# Altium schematic sheet Main Controller.SchDoc: Microcontrollers and Peripherals
size A4; Date: May 2021; Revision: 1.0; SheetNumber: 1; SheetTotal: 1
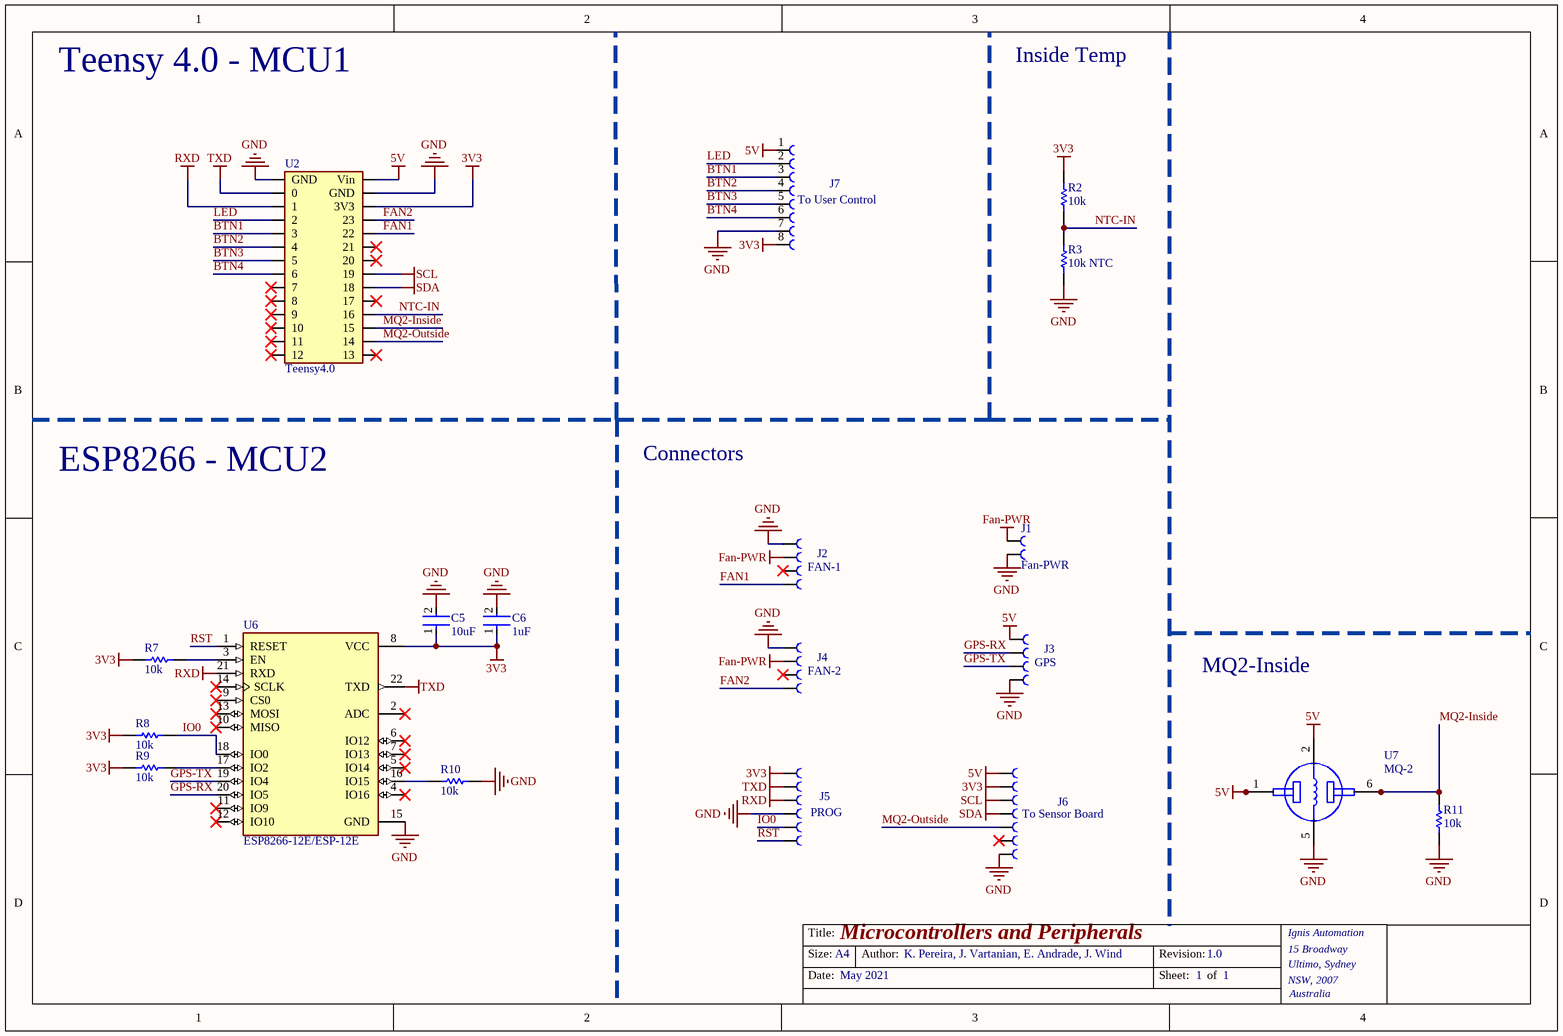
[diagram p0: Main Controller.SchDoc]

## Parts
C5  10uF  [FP-CL10-IPC_C]
C6  1uF  [FP-CL10-IPC_C]
J1  Fan-PWR  [61300711821]
J2  FAN-1  [61300711821]
J3  GPS  [61300711821]
J4  FAN-2  [61300711821]
J5  PROG  [61300711821]
J6  To Sensor Board  [61300711821]
J7  To User Control  [61300711821]
R2  10k  [RESC1608X55X30NL15T15]
R3  10k NTC  [RESC1608X55X30NL15T15]
R7  10k  [RESC1608X55X30NL15T15]
R8  10k  [RESC1608X55X30NL15T15]
R9  10k  [RESC1608X55X30NL15T15]
R10  10k  [RESC1608X55X30NL15T15]
R11  10k  [RESC1608X55X30NL15T15]
U2  Teensy4.0  [61301411821]
U6  ESP8266-12E/ESP-12E  [XCVR_ESP8266-12E/ESP-12E]
U7  MQ-2  [XDCR_SEN-08880]

## Nets
3V3: C5.1 C6.1 J5.1 J6.2 J7.8 R2.2 R7.1 R8.1 R9.1 U2.26(3V3) U6.8(VCC)
5V: J3.1 J6.1 J7.1 U2.28(Vin) U7.1(A) U7.2(H1) U7.3(A)
Fan-PWR: J1.2 J2.2 J4.2
GND: C5.2 C6.2 J1.1 J2.1 J3.4 J4.1 J5.4 J6.7 J7.7 R3.1 R10.2 R11.1 U2.1(GND) U2.27(GND) U6.15(GND) U7.5(H2)
RXD: J5.3 U2.3(1) U6.21(RXD)
SCL: J6.3 U2.21(19)
SDA: J6.4 U2.20(18)
TXD: J5.2 U2.2(0) U6.22(TXD)
BTN1: J7.3 U2.5(3)
BTN2: J7.4 U2.6(4)
BTN3: J7.5 U2.7(5)
BTN4: J7.6 U2.8(6)
FAN1: J2.4 U2.24(22)
FAN2: J4.4 U2.25(23)
GPS-RX: J3.2 U6.20(IO5)
GPS-TX: J3.3 U6.19(IO4)
IO0: J5.5 R8.2 U6.18(IO0)
LED: J7.2 U2.4(2)
MQ2-Inside: R11.2 U2.17(15) U7.4(B) U7.6(B)
MQ2-Outside: J6.5 U2.16(14)
NTC-IN: R2.1 R3.2 U2.18(16)
RST: J5.6 U6.1(RESET)
NetR7_2: R7.2 U6.3(EN)
NetR9_2: R9.2 U6.17(IO2)
NetR10_1: R10.1 U6.16(IO15)

Not connected (* = marked no-connect by the designer): J2 3*; J4 3*; J6 6*; U2 9(7)* 10(8)* 11(9)* 12(10)* 13(11)* 14(12)* 15(13)* 19(17)* 22(20)* 23(21)*; U6 2(ADC)* 4(IO16)* 5(IO14)* 6(IO12)* 7(IO13)* 9(CS0)* 10(MISO)* 11(IO9)* 12(IO10)* 13(MOSI)* 14(SCLK)*

## Notes on the sheet
- Teensy 4.0 - MCU1
- Inside Temp
- ESP8266 - MCU2
- Connectors
- MQ2-Inside
- Title:
- Size:
- Date:
- A4
- Author:
- K. Pereira, J. Vartanian, E. Andrade, J. Wind
- Revision:
- Sheet:
- of
- Ignis Automation
- 15 Broadway
- Ultimo, Sydney
- NSW, 2007
- Australia

## Library data of the parts
C5 = CMP-13271-003248-1: CAP CER 10UF 16V X5R 0603; Part Number: 587-3238-1-ND
C6 = CMP-13271-003248-1: CAP CER 1UF 25V X5R 0603; Part Number: 1276-1102-1-ND
J1 = 61300711821: 2 Pin
J2-J4 = 61300711821: 4 Pin
J5 = 61300711821: 6 Pin
J6 = 61300711821: 7 Pin
J7 = 61300711821: 8 Pin; MF: WÃ¼rth Elektronik; Check_prices: https://www.snapeda.com/parts/61300711821/W%C3%BCrth%20Elektronik/view-part/2704590/?ref=eda; Price: None; Availability: Unavailable; Value: *; SnapEDA_Link: https://www.snapeda.com/parts/61300711821/W%C3%BCrth%20Elektronik/view-part/2704590/?ref=snap; Package: None; MP: 61300711821
R2 R7-R11 = CMP-2000-00180-1: RES SMD 10K OHM 1% 1/10W 0603; Part Number: A121523CT-ND
R3 = CMP-2000-00180-1: THERMISTOR NTC 10KOHM 4250K 0603; Part Number: P10547CT-ND
U6 = ESP8266-12E/ESP-12E: RX TXRX MOD WIFI TRACE ANT SMD; Part Number: 1528-1438-ND
U7 = MQ-2: MQ-2 Gas Sensor